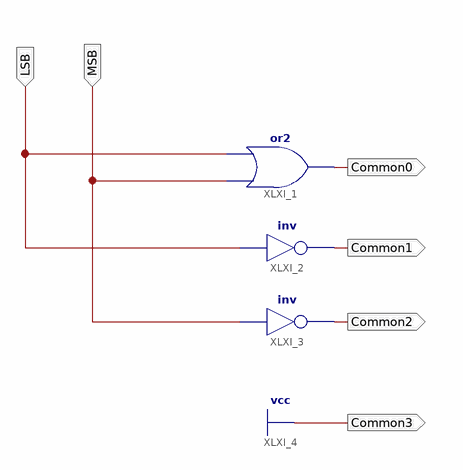
[diagram p0: schematic sheet 1]
// Xilinx ISE schematic CommonControl.sch (spartan6) as structural Verilog: 3 symbols, 6 ports
module CommonControl (
  input  MSB,
  input  LSB,
  output Common0,
  output Common1,
  output Common2,
  output Common3
);

  or XLXI_1 (Common0, MSB, LSB);
  not XLXI_2 (Common1, LSB);
  not XLXI_3 (Common2, MSB);

  assign Common3 = 1'b1;
endmodule
